# Altium schematic sheet Main.SchDoc
size A; SheetNumber: 1; SheetTotal: 10
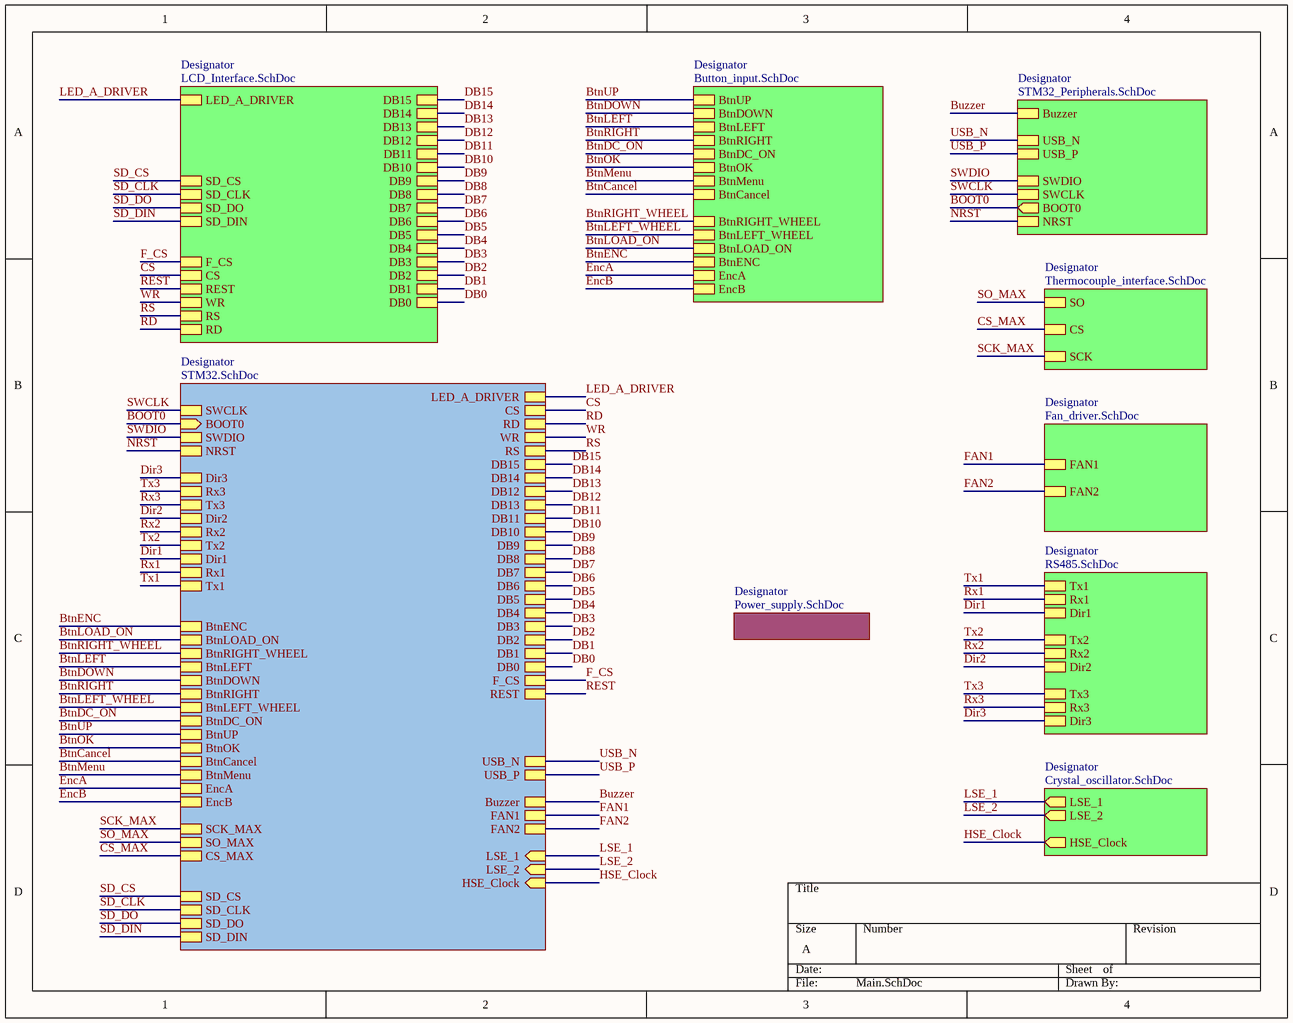
[diagram p0: Main.SchDoc]

## Sub-sheets
Designator = Thermocouple_interface.SchDoc: SO, CS, SCK
Designator = Fan_driver.SchDoc: FAN1, FAN2
Designator = RS485.SchDoc: Tx1, Rx1, Dir1, Tx2, Rx2, Dir2, Tx3, Rx3, Dir3
Designator = Button_input.SchDoc: BtnUP, BtnDOWN, BtnLEFT, BtnRIGHT, BtnDC_ON, BtnOK, BtnRIGHT_WHEEL, BtnLEFT_WHEEL, BtnLOAD_ON, BtnENC, EncA, EncB, BtnMenu, BtnCancel
Designator = Crystal_oscillator.SchDoc: LSE_1 (out), LSE_2 (out), HSE_Clock (out)
Designator = LCD_Interface.SchDoc: SD_CLK, SD_DO, SD_DIN, SD_CS, LED_A_DRIVER, F_CS, CS, WR, REST, RS, RD, DB15, DB14, DB13, DB12, DB11, DB10, DB9, DB7, DB8, DB6, DB5, DB4, DB3, DB2, DB1, DB0
Designator = STM32_Peripherals.SchDoc: Buzzer, USB_N, USB_P, SWDIO, SWCLK, BOOT0 (out), NRST
Designator = STM32.SchDoc: SWCLK, SWDIO, BOOT0 (in), NRST, Buzzer, USB_N, USB_P, BtnENC, BtnLOAD_ON, BtnRIGHT_WHEEL, EncA, BtnMenu, BtnCancel, EncB, BtnLEFT, BtnDOWN, BtnUP, BtnRIGHT, BtnLEFT_WHEEL, BtnDC_ON, BtnOK, FAN1, FAN2, SO_MAX, SCK_MAX, HSE_Clock (in), LSE_2 (in), LSE_1 (in), LED_A_DRIVER, SD_CS, SD_CLK, SD_DO, SD_DIN, REST, F_CS, RD, WR, RS, DB15, DB14, DB13, DB12, DB11, DB10, DB9, DB8, DB7, DB5, DB6, DB4, DB3, DB2, DB1, DB0, CS, Tx1, Rx1, Dir1, Tx2, Rx2, Dir2, Tx3, Rx3, Dir3, CS_MAX
Designator = Power_supply.SchDoc: no entries

## Nets
BOOT0: sheet Designator/BOOT0, sheet Designator/BOOT0
BtnCancel: sheet Designator/BtnCancel, sheet Designator/BtnCancel
BtnDC_ON: sheet Designator/BtnDC_ON, sheet Designator/BtnDC_ON
BtnDOWN: sheet Designator/BtnDOWN, sheet Designator/BtnDOWN
BtnENC: sheet Designator/BtnENC, sheet Designator/BtnENC
BtnLEFT: sheet Designator/BtnLEFT, sheet Designator/BtnLEFT
BtnLEFT_WHEEL: sheet Designator/BtnLEFT_WHEEL, sheet Designator/BtnLEFT_WHEEL
BtnLOAD_ON: sheet Designator/BtnLOAD_ON, sheet Designator/BtnLOAD_ON
BtnMenu: sheet Designator/BtnMenu, sheet Designator/BtnMenu
BtnOK: sheet Designator/BtnOK, sheet Designator/BtnOK
BtnRIGHT: sheet Designator/BtnRIGHT, sheet Designator/BtnRIGHT
BtnRIGHT_WHEEL: sheet Designator/BtnRIGHT_WHEEL, sheet Designator/BtnRIGHT_WHEEL
BtnUP: sheet Designator/BtnUP, sheet Designator/BtnUP
Buzzer: sheet Designator/Buzzer, sheet Designator/Buzzer
CS: sheet Designator/CS, sheet Designator/CS
CS_MAX: sheet Designator/CS, sheet Designator/CS_MAX
DB0: sheet Designator/DB0, sheet Designator/DB0
DB1: sheet Designator/DB1, sheet Designator/DB1
DB2: sheet Designator/DB2, sheet Designator/DB2
DB3: sheet Designator/DB3, sheet Designator/DB3
DB4: sheet Designator/DB4, sheet Designator/DB4
DB5: sheet Designator/DB5, sheet Designator/DB5
DB6: sheet Designator/DB6, sheet Designator/DB6
DB7: sheet Designator/DB7, sheet Designator/DB7
DB8: sheet Designator/DB8, sheet Designator/DB8
DB9: sheet Designator/DB9, sheet Designator/DB9
DB10: sheet Designator/DB10, sheet Designator/DB10
DB11: sheet Designator/DB11, sheet Designator/DB11
DB12: sheet Designator/DB12, sheet Designator/DB13
DB13: sheet Designator/DB13, sheet Designator/DB12
DB14: sheet Designator/DB14, sheet Designator/DB14
DB15: sheet Designator/DB15, sheet Designator/DB15
Dir1: sheet Designator/Dir1, sheet Designator/Dir1
Dir2: sheet Designator/Dir2, sheet Designator/Dir2
Dir3: sheet Designator/Dir3, sheet Designator/Dir3
EncA: sheet Designator/EncA, sheet Designator/EncA
EncB: sheet Designator/EncB, sheet Designator/EncB
F_CS: sheet Designator/F_CS, sheet Designator/F_CS
FAN1: sheet Designator/FAN1, sheet Designator/FAN1
FAN2: sheet Designator/FAN2, sheet Designator/FAN2
HSE_Clock: sheet Designator/HSE_Clock, sheet Designator/HSE_Clock
LED_A_DRIVER: sheet Designator/LED_A_DRIVER, sheet Designator/LED_A_DRIVER
LSE_1: sheet Designator/LSE_1, sheet Designator/LSE_1
LSE_2: sheet Designator/LSE_2, sheet Designator/LSE_2
NRST: sheet Designator/NRST, sheet Designator/NRST
RD: sheet Designator/RD, sheet Designator/RD
REST: sheet Designator/REST, sheet Designator/REST
RS: sheet Designator/RS, sheet Designator/RS
Rx1: sheet Designator/Rx1, sheet Designator/Rx1
Rx2: sheet Designator/Rx2, sheet Designator/Rx2
Rx3: sheet Designator/Rx3, sheet Designator/Tx3
SCK_MAX: sheet Designator/SCK, sheet Designator/SCK_MAX
SD_CLK: sheet Designator/SD_CLK, sheet Designator/SD_CLK
SD_CS: sheet Designator/SD_CS, sheet Designator/SD_CS
SD_DIN: sheet Designator/SD_DIN, sheet Designator/SD_DIN
SD_DO: sheet Designator/SD_DO, sheet Designator/SD_DO
SO_MAX: sheet Designator/SO, sheet Designator/SO_MAX
SWCLK: sheet Designator/SWCLK, sheet Designator/SWCLK
SWDIO: sheet Designator/SWDIO, sheet Designator/SWDIO
Tx1: sheet Designator/Tx1, sheet Designator/Tx1
Tx2: sheet Designator/Tx2, sheet Designator/Tx2
Tx3: sheet Designator/Tx3, sheet Designator/Rx3
USB_N: sheet Designator/USB_N, sheet Designator/USB_N
USB_P: sheet Designator/USB_P, sheet Designator/USB_P
WR: sheet Designator/WR, sheet Designator/WR